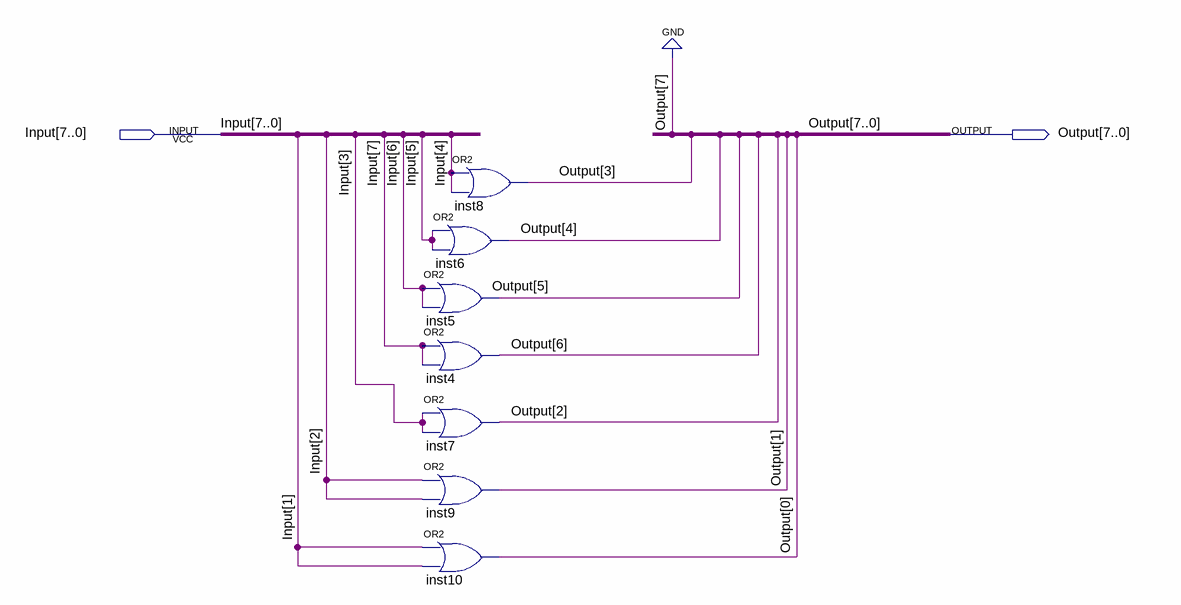
[diagram p0: schematic sheet]
// Quartus schematic SHIFT_1.bdf as structural Verilog: 7 symbols, 2 pins
module SHIFT_1 (
  input  [7:0] Input,
  output [7:0] Output
);

  or inst6 (Output[4], Input[5], Input[5]);
  or inst5 (Output[5], Input[6], Input[6]);
  or inst4 (Output[6], Input[7], Input[7]);
  or inst7 (Output[2], Input[3], Input[3]);
  or inst9 (Output[1], Input[2], Input[2]);
  or inst10 (Output[0], Input[1], Input[1]);
  or inst8 (Output[3], Input[4], Input[4]);

  assign Output[7] = 1'b0;
endmodule
